# EasyEDA schematic Schematic_easyeda.json
TITLE: Sheet_1; REV: 1.0; Date: 2023-10-18; Sheet: 1/1; Drawn By: kishore14159; Company: Your Company
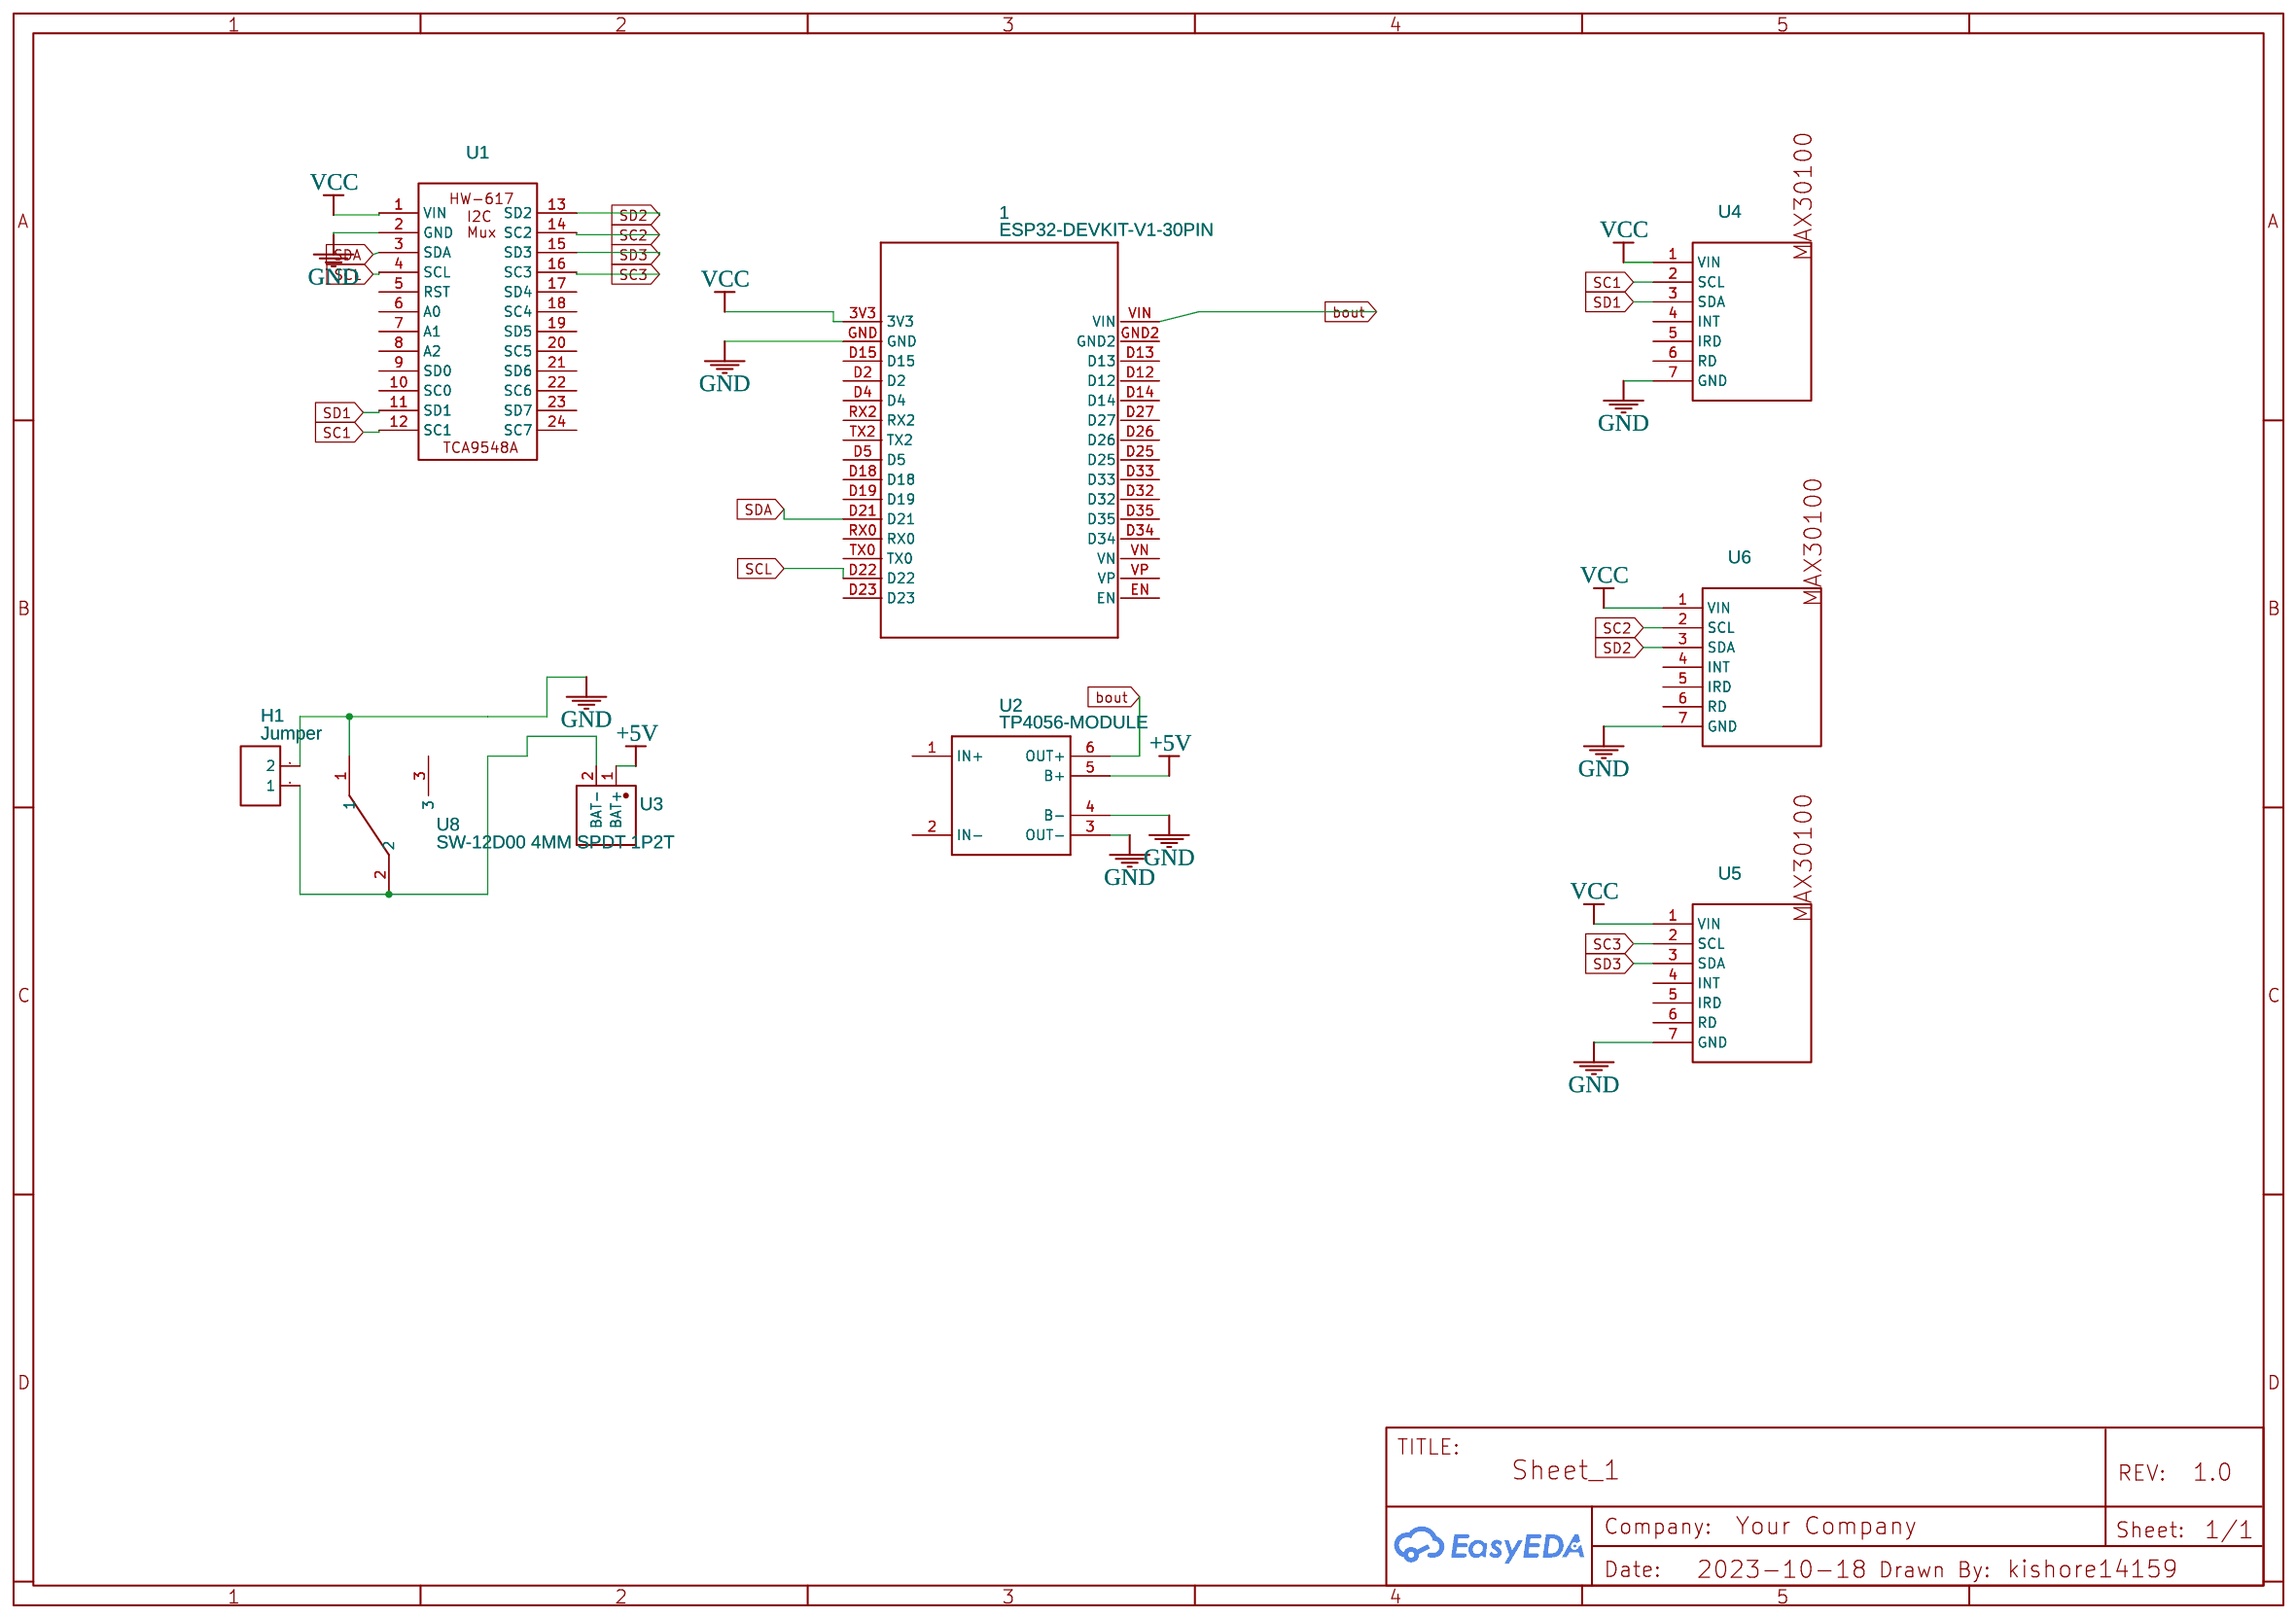
[diagram p0: schematic sheet]

## Parts
1  ESP32-DEVKIT-V1-30PIN  [ESP32-DEVKIT-V1-FP-30PIN]
H1  Jumper  [HDR-F-2.54_1X2]
U1  NO  [TCA9548A BOARD]
U2  TP4056-MODULE  [TP4056-MODULE]
U3  NO  [JST-PH-JST-PH2]
U4  NO  [MAX30100_MODULE]
U5  NO  [MAX30100_MODULE]
U6  NO  [MAX30100_MODULE]
U8  SW-12D00 4MM SPDT 1P2T  [SS-12D00 4MM SPDT 1P2T]

## Library data of the parts
1 = ESP32-DEVKIT-V1-30PIN: Contributor: janos250
H1 = HDR-F-2.54_1x2: Supplier Part: C49661; Supplier: LCSC; Contributor: LCEDA_Lib
U1 = TCA9548A HW-617_OK: Manufacturer: Texas Instruments; Manufacturer Part: TCA9548A; Supplier: Adafruit; Supplier Part: 2717; link: https://www.adafruit.com/product/2717; Contributor: joshgarde
U2 = TP4056-MODULE: null; Contributor: Rajn
U3 = JST-PH-JST-PH2: Contributor: julian.boet
U4-U6 = MAX30100 MODULE: link: https://www.aliexpress.com/item/32810459983.html?spm=a2g0o.detail.1000014.15.214c142fA81ZN8&gps-id=pcDetailBottomMoreOtherSeller&scm=1007.13338.136874&scm_id=1007.13338.136874&scm-url=1007.13338.136874&pvid=a0309ad8-d53b-48bd-8c58-b77e664b8125; Contributor: Subhankar Choudhury
U8 = SW-12D00 4MM SPDT 1P2T: Supplier: CopIoTs; Contributor: huyzhduong

## Nets
+5V: U2.5(B+) U3.1(BAT+)
GND: 1.GND H1.2 U1.2(GND) U2.3(OUT-) U2.4(B-) U4.7(GND) U5.7(GND) U6.7(GND) U8.1
VCC: 1.3V3 U1.1(VIN) U4.1(VIN) U5.1(VIN) U6.1(VIN)
bout: 1.VIN U2.6(OUT+)
SC1: U1.12(SC1) U4.2(SCL)
SC2: U1.14(SC2) U6.2(SCL)
SC3: U1.16(SC3) U5.2(SCL)
SCL: 1.D22 U1.4(SCL)
SD1: U1.11(SD1) U4.3(SDA)
SD2: U1.13(SD2) U6.3(SDA)
SD3: U1.15(SD3) U5.3(SDA)
SDA: 1.D21 U1.3(SDA)
Net-(H1-1): H1.1 U3.2(BAT-) U8.2

Not connected (* = marked no-connect by the designer): 1 D2 D4 D5 D12 D13 D14 D15 D18 D19 D23 D25 D26 D27 D32 D33 D34 D35 EN GND2 RX0 RX2 TX0 TX2 VN VP; U1 5(RST) 6(A0) 7(A1) 8(A2) 9(SD0) 10(SC0) 17(SD4) 18(SC4) 19(SD5) 20(SC5) 21(SD6) 22(SC6) 23(SD7) 24(SC7); U2 1(IN+) 2(IN-); U4 4(INT) 5(IRD) 6(RD); U5 4(INT) 5(IRD) 6(RD); U6 4(INT) 5(IRD) 6(RD); U8 3
